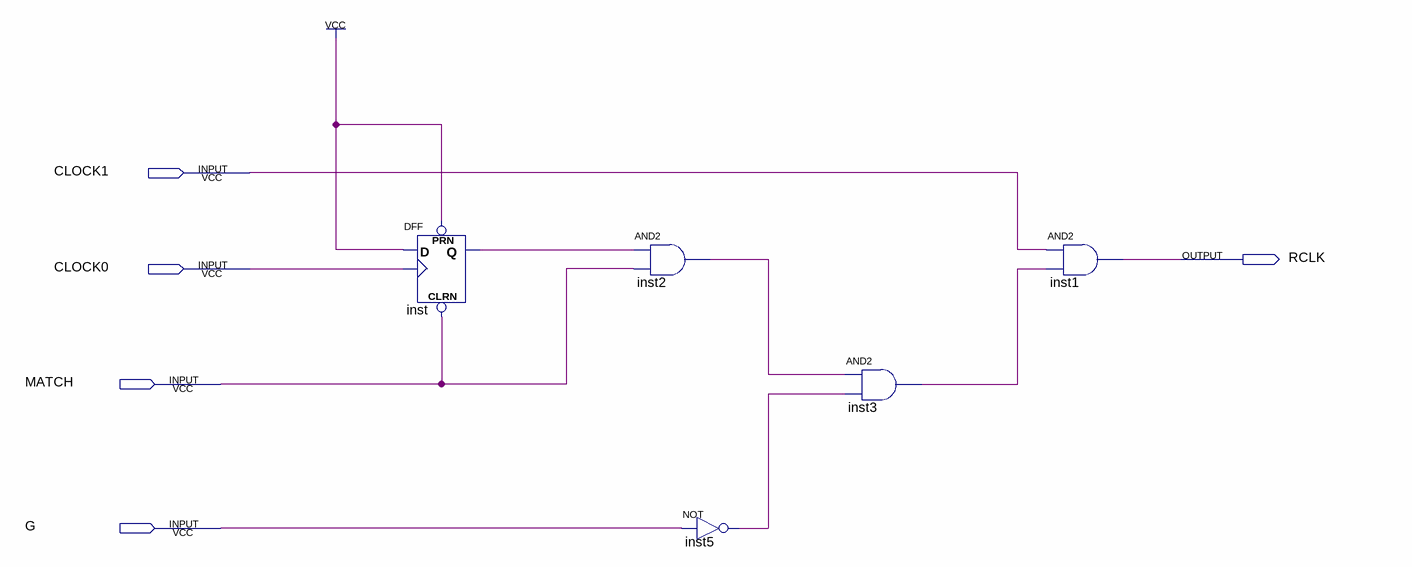
[diagram p0: schematic sheet]
// Quartus schematic RCLK1.bdf as structural Verilog: 5 symbols, 5 pins
module RCLK1 (
  input  CLOCK1,
  input  CLOCK0,
  input  MATCH,
  input  G,
  output RCLK
);

  wire inst2_out, inst3_out, inst5_out, inst_q;

  DFF inst (.CLRN(MATCH), .CLK(CLOCK0), .D(1'b1), .PRN(1'b1), .Q(inst_q));
  and inst2 (inst2_out, inst_q, MATCH);
  not inst5 (inst5_out, G);
  and inst3 (inst3_out, inst2_out, inst5_out);
  and inst1 (RCLK, CLOCK1, inst3_out);
endmodule
